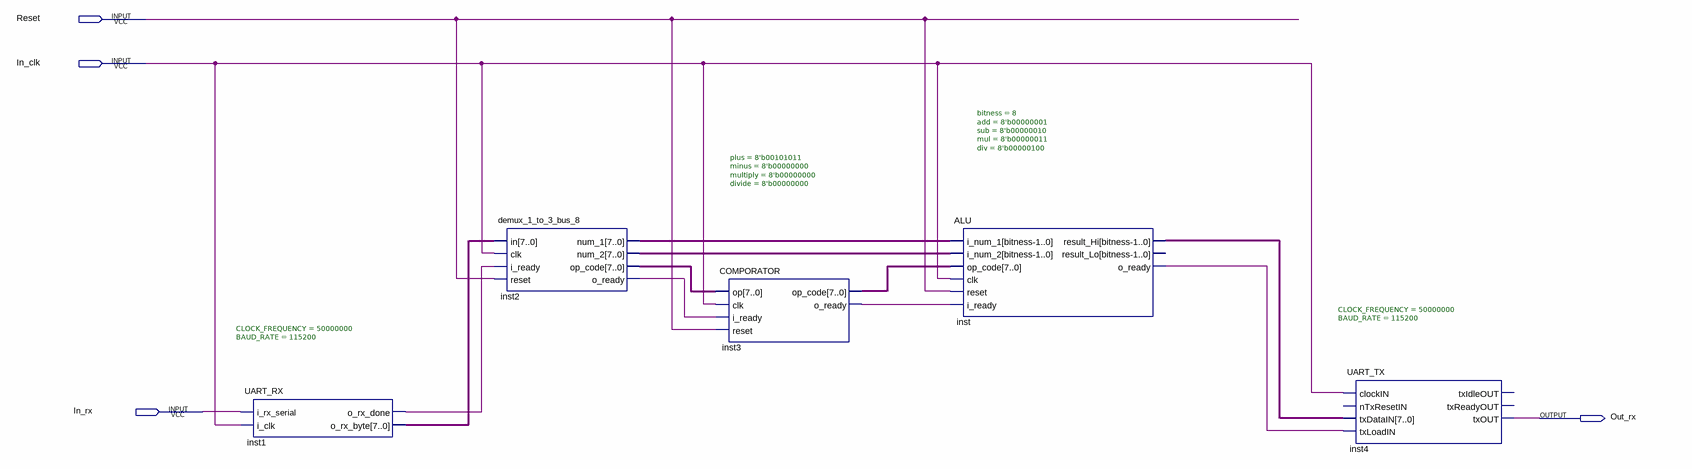
[diagram p0: schematic sheet]
// Quartus schematic Main_Block.bdf as structural Verilog: 5 symbols, 4 pins
module Main_Block (
  input  Reset,
  input  In_clk,
  input  In_rx,
  output Out_rx
);

  wire inst1_o_rx_done, inst2_o_ready, inst3_o_ready, inst_o_ready;
  wire [7:0] inst1_o_rx_byte, inst2_num_1, inst2_num_2, inst2_op_code, inst3_op_code, inst_result_hi;

  UART_RX #(.CLOCK_FREQUENCY(50000000), .BAUD_RATE(115200)) inst1 (
    .i_rx_serial(In_rx), .i_clk(In_clk), .o_rx_done(inst1_o_rx_done), .o_rx_byte(inst1_o_rx_byte));
  demux_1_to_3_bus_8 inst2 (
    .in(inst1_o_rx_byte), .clk(In_clk), .i_ready(inst1_o_rx_done), .reset(Reset), .num_1(inst2_num_1),
    .num_2(inst2_num_2), .op_code(inst2_op_code), .o_ready(inst2_o_ready));
  COMPORATOR #(.plus(8'b00101011), .minus(8'b00000000), .multiply(8'b00000000), .divide(8'b00000000)) inst3 (
    .op(inst2_op_code), .clk(In_clk), .i_ready(inst2_o_ready), .reset(Reset), .op_code(inst3_op_code),
    .o_ready(inst3_o_ready));
  ALU #(.bitness(8), .add(8'b00000001), .sub(8'b00000010), .mul(8'b00000011), .div(8'b00000100)) inst (
    .i_num_1(inst2_num_1), .i_num_2(inst2_num_2), .op_code(inst3_op_code), .clk(In_clk), .reset(Reset),
    .i_ready(inst3_o_ready), .result_Hi(inst_result_hi), .o_ready(inst_o_ready));  // open: result_Lo
  UART_TX #(.CLOCK_FREQUENCY(50000000), .BAUD_RATE(115200)) inst4 (
    .clockIN(In_clk), .txDataIN(inst_result_hi), .txLoadIN(inst_o_ready), .txOUT(Out_rx));  // open: nTxResetIN, txIdleOUT, txReadyOUT
endmodule
